# EAGLE design rxfirst (EAGLE 9.5.1)
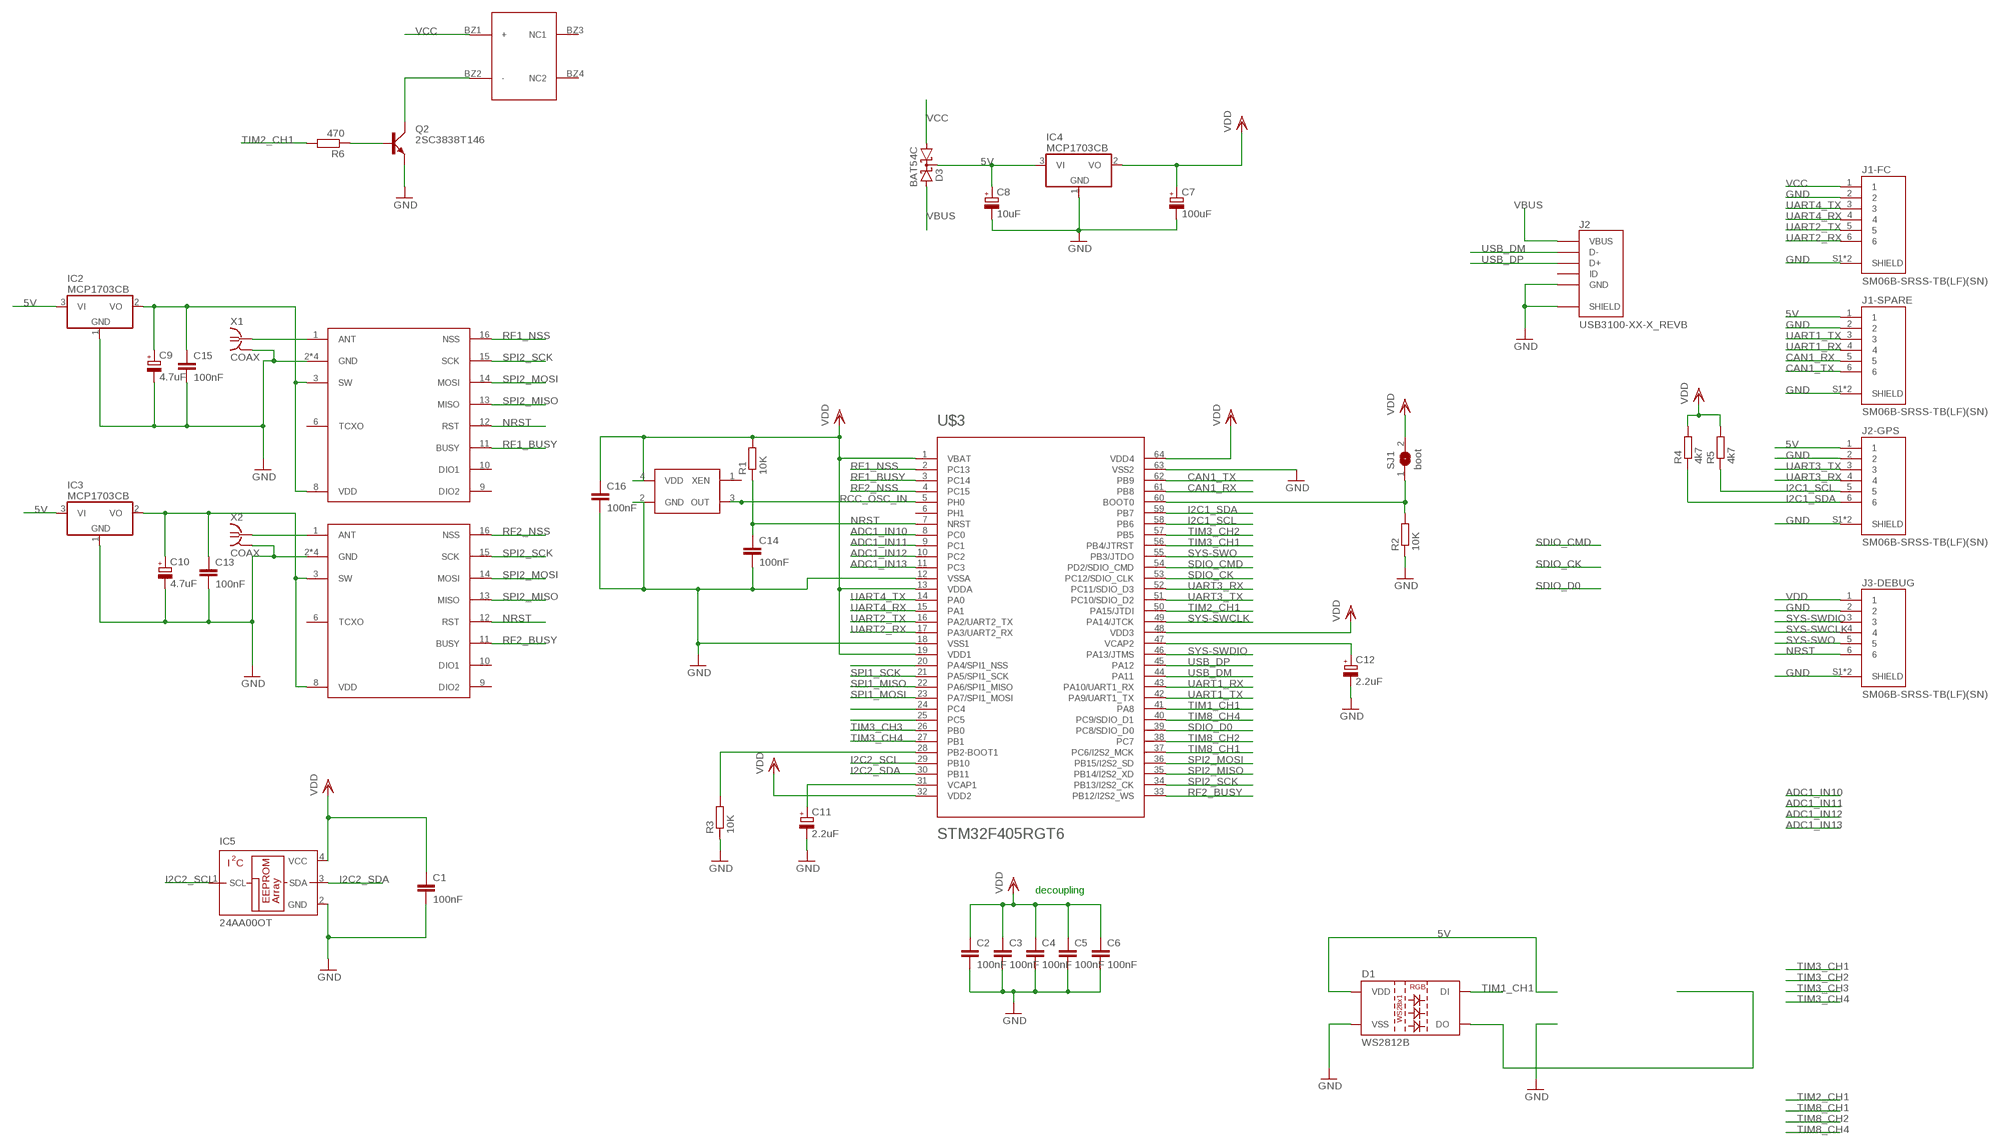
[diagram p0: schematic, sheet 1]

## Parts
C1  100nF  C-EUC0603  [C0603]
C2  100nF  C-EUC0603  [C0603]
C3  100nF  C-EUC0603  [C0603]
C4  100nF  C-EUC0603  [C0603]
C5  100nF  C-EUC0603  [C0603]
C6  100nF  C-EUC0603  [C0603]
C7  100uF  CPOL-EUSMCA  [SMC_A]
C8  10uF  CPOL-EUSMCA  [SMC_A]
C9  4.7uF  CPOL-EUSMCA  [SMC_A]
C10  4.7uF  CPOL-EUSMCA  [SMC_A]
C11  2.2uF  CPOL-EUSMCA  [SMC_A]
C12  2.2uF  CPOL-EUSMCA  [SMC_A]
C13  100nF  C-EUC0603  [C0603]
C14  100nF  C-EUC0603  [C0603]
C15  100nF  C-EUC0603  [C0603]
C16  100nF  C-EUC0603  [C0603]
D1  WS2812B  [WS2812B]
D3  BAT54C  [SOT23]
IC2  MCP1703CB  [SOT23]
IC3  MCP1703CB  [SOT23]
IC4  MCP1703CB  [SOT23]
IC5  24AA00OT  [SOT23-5L]
J1-FC  SM06B-SRSS-TB(LF)(SN)  [JST_SM06B-SRSS-TB(LF)(SN)]
J1-SPARE  SM06B-SRSS-TB(LF)(SN)  [JST_SM06B-SRSS-TB(LF)(SN)]
J2  USB3100-XX-X_REVB  [GCT_USB3100-XX-X_REVB]
J2-GPS  SM06B-SRSS-TB(LF)(SN)  [JST_SM06B-SRSS-TB(LF)(SN)]
J3-DEBUG  SM06B-SRSS-TB(LF)(SN)  [JST_SM06B-SRSS-TB(LF)(SN)]
Q2  2SC3838T146  [SC59]
R1  10K  R-EU_R0603  [R0603]
R2  10K  R-EU_R0603  [R0603]
R3  10K  R-EU_R0603  [R0603]
R4  4k7  R-EU_R0603  [R0603]
R5  4k7  R-EU_R0603  [R0603]
R6  470  R-EU_R0603  [R0603]
RF1  DRF1262T  [SMD]
RF2  DRF1262T  [SMD]
SJ1  boot  SJ  [SJ]
U$1  BZ  [SND]
U$3  STM32F405RGT6  STM32F405RG  [TQFP64]
U$4  XO  [SMD]
X1  COAX  [MMCX-J-P-X-ST-EM1-MKT]
X2  COAX  [MMCX-J-P-X-ST-EM1-MKT]

## Nets
5V: C8.+ D1.1(VDD) D3.3(CC) IC2.3(VI) IC3.3(VI) IC4.3(VI) J1-SPARE.1 J2-GPS.1
ADC1_IN10: U$3.8(PC0)
ADC1_IN11: U$3.9(PC1)
ADC1_IN12: U$3.10(PC2)
ADC1_IN13: U$3.11(PC3)
CAN1_RX: J1-SPARE.5 U$3.61(PB8)
CAN1_TX: J1-SPARE.6 U$3.62(PB9)
GND: C1.2 C2.2 C3.2 C4.2 C5.2 C6.2 C7.- C8.- C9.- C10.- C11.- C12.- C13.2 C14.2 C15.2 C16.2 D1.3(VSS) IC2.1(GND) IC3.1(GND) IC4.1(GND) IC5.2(GND) J1-FC.2 J1-FC.S1(SHIELD) J1-FC.S2(SHIELD) J1-SPARE.2 J1-SPARE.S1(SHIELD) J1-SPARE.S2(SHIELD) J2-GPS.2 J2-GPS.S1(SHIELD) J2-GPS.S2(SHIELD) J2.5(GND) J2.6(SHIELD) J2.7(SHIELD) J2.8(SHIELD) J2.9(SHIELD) J3-DEBUG.2 J3-DEBUG.S1(SHIELD) J3-DEBUG.S2(SHIELD) Q2.E R2.1 R3.1 RF1.2(GND) RF1.4(GND) RF1.5(GND) RF1.7(GND) RF2.2(GND) RF2.4(GND) RF2.5(GND) RF2.7(GND) U$3.12(VSSA) U$3.18(VSS1) U$3.63(VSS2) U$4.2(GND) X1.2@1(GND) X2.2@1(GND)
I2C1_SCL: J2-GPS.5 R5.1 U$3.58(PB6)
I2C1_SDA: J2-GPS.6 R4.1 U$3.59(PB7)
I2C2_SCL: IC5.1(SCL) U$3.29(PB10)
I2C2_SDA: IC5.3(SDA) U$3.30(PB11)
N$1: RF1.1(ANT) X1.1
N$2: R3.2 U$3.28(PB2-BOOT1)
N$3: RF2.1(ANT) X2.1
N$4: C12.+ U$3.47(VCAP2)
N$5: D1.2(DO)
N$6: C9.+ C15.1 IC2.2(VO) RF1.3(SW) RF1.8(VDD)
N$7: C10.+ C13.1 IC3.2(VO) RF2.3(SW) RF2.8(VDD)
N$8: Q2.B R6.1
N$9: Q2.C U$1.BZ2(-)
N$34: U$3.20(PA4/SPI1_NSS)
N$38: U$3.24(PC4)
N$39: U$3.25(PC5)
N$45: C11.+ U$3.31(VCAP1)
N$54: R2.2 SJ1.1 U$3.60(BOOT0)
NRST: C14.1 J3-DEBUG.6 R1.1 RF1.12(RST) RF2.12(RST) U$3.7(NRST)
RCC_OSC_IN: U$3.5(PH0) U$4.3(OUT)
RF1_BUSY: RF1.11(BUSY) U$3.3(PC14)
RF1_NSS: RF1.16(NSS) U$3.2(PC13)
RF2_BUSY: RF2.11(BUSY) U$3.33(PB12/I2S2_WS)
RF2_NSS: RF2.16(NSS) U$3.4(PC15)
SDIO_CK: U$3.53(PC12/SDIO_CLK)
SDIO_CMD: U$3.54(PD2/SDIO_CMD)
SDIO_D0: U$3.39(PC8/SDIO_D0)
SPI1_MISO: U$3.22(PA6/SPI1_MISO)
SPI1_MOSI: U$3.23(PA7/SPI1_MOSI)
SPI1_SCK: U$3.21(PA5/SPI1_SCK)
SPI2_MISO: RF1.13(MISO) RF2.13(MISO) U$3.35(PB14/I2S2_XD)
SPI2_MOSI: RF1.14(MOSI) RF2.14(MOSI) U$3.36(PB15/I2S2_SD)
SPI2_SCK: RF1.15(SCK) RF2.15(SCK) U$3.34(PB13/I2S2_CK)
SYS-SWCLK: J3-DEBUG.4 U$3.49(PA14/JTCK)
SYS-SWDIO: J3-DEBUG.3 U$3.46(PA13/JTMS)
SYS-SWO: J3-DEBUG.5 U$3.55(PB3/JTDO)
TIM1_CH1: D1.4(DI) U$3.41(PA8)
TIM2_CH1: R6.2 U$3.50(PA15/JTDI)
TIM3_CH1: U$3.56(PB4/JTRST)
TIM3_CH2: U$3.57(PB5)
TIM3_CH3: U$3.26(PB0)
TIM3_CH4: U$3.27(PB1)
TIM8_CH1: U$3.37(PC6/I2S2_MCK)
TIM8_CH2: U$3.38(PC7)
TIM8_CH4: U$3.40(PC9/SDIO_D1)
UART1_RX: J1-SPARE.4 U$3.43(PA10/UART1_RX)
UART1_TX: J1-SPARE.3 U$3.42(PA9/UART1_TX)
UART2_RX: J1-FC.6 U$3.17(PA3/UART2_RX)
UART2_TX: J1-FC.5 U$3.16(PA2/UART2_TX)
UART3_RX: J2-GPS.4 U$3.52(PC11/SDIO_D3)
UART3_TX: J2-GPS.3 U$3.51(PC10/SDIO_D2)
UART4_RX: J1-FC.4 U$3.15(PA1)
UART4_TX: J1-FC.3 U$3.14(PA0)
USB_DM: J2.2(D-) U$3.44(PA11)
USB_DP: J2.3(D+) U$3.45(PA12)
VBUS: D3.2(A2) J2.1(VBUS)
VCC: D3.1(A1) J1-FC.1 U$1.BZ1(+)
VDD: C1.1 C2.1 C3.1 C4.1 C5.1 C6.1 C7.+ C16.1 IC4.2(VO) IC5.4(VCC) J3-DEBUG.1 R1.2 R4.2 R5.2 SJ1.2 U$3.1(VBAT) U$3.13(VDDA) U$3.19(VDD1) U$3.32(VDD2) U$3.48(VDD3) U$3.64(VDD4) U$4.4(VDD)
Unconnected: J2.4(ID) RF1.6(TCXO) RF1.9(DIO2) RF1.10(DIO1) RF2.6(TCXO) RF2.9(DIO2) RF2.10(DIO1) U$1.BZ3(NC1) U$1.BZ4(NC2) U$3.6(PH1) U$4.1(XEN)

## Notes on the sheet
- decoupling

## Power pins joined to a net without a drawn wire
GND: X1.2@2(GND) X1.2@3(GND) X1.2@4(GND) X2.2@2(GND) X2.2@3(GND) X2.2@4(GND)

## Library data of the parts
C1-C6 C13-C16 = rcl:C-EU: CAPACITOR, European symbol; SPICEPREFIX: C
C7-C12 = rcl:CPOL-EU: POLARIZED CAPACITOR, European symbol; SPICEPREFIX: C
D1 = SparkFun-LED:WS2812B: WS2812B SMD addressable RGB LED 5x5mm SMD LED with built-in controller IC. Color: Red/Green/Blue mC Rating: RGB: 390, 660, 180 mcd Forward Voltage: RGB: 2.0, 3.0, 3.0 V Packages:WS2812B SparkFun Products: Blynk Board - ESP8266 <https://www.sparkfun.com/products/13794>; PROD_ID: DIO-12503
D3 = diode:BAT54C: Schottky Diodes Source: Fairchild .. BAT54.pdf
IC2-IC4 = linear:MCP1703: 250 mA, 16V, Low Quiescent Current LDO Regulator Source: http://ww1.microchip.com/downloads/en/DeviceDoc/22049b.pdf
IC5 = microchip:24*00: Serial EEPROM 128 bit, I2C (AA = 1.8 V/LC = 2.5 V/C = 5.0 V); MF: MICROCHIP; MPN: 24AA00T-I/OTG; OC_FARNELL: 1331264; OC_NEWARK: 89H3038
J1-FC J1-SPARE J2-GPS J3-DEBUG = SM06B-SRSS-TB_LF__SN_:SM06B-SRSS-TB(LF)(SN): SH Series 6 Position 1 mm Surface Mount Right Angle Side Entry Shrouded Header; AVAILABILITY: Unavailable; DESCRIPTION: SH Series 6 Position 1 mm Surface Mount Right Angle Side Entry Shrouded Header; MF: JST Sales; MP: SM06B-SRSS-TB_LF__SN_; PACKAGE: None; PRICE: None
J2 = USB3100-XX-X_REVB:USB3100-XX-X_REVB: Micro USB Receptacle, Type B, Surface Mount, Horizontal, Top (Reverse) Mount, without Peg; AVAILABILITY: Unavailable; DESCRIPTION: USB3100 Series 5 Pin SMT Right Angle Top Mount Micro USB Receptacle; MF: Global Connector Technology; MP: USB3100-30-A; PACKAGE: None; PRICE: None
Q2 = transistor-small-signal:2SC3838: High-Frequency Amplifier Transistor 11V, 50mA, 3.2GHz (Rohm)
R1-R6 = rcl:R-EU_: RESISTOR, European symbol; SPICEPREFIX: R
RF1 RF2 = Dorji:DRF1262T
SJ1 = jumper:SJ: SMD solder JUMPER
U$1 = buzzer:BZ
U$3 = SparkFun-IC-Microcontroller:STM32F405RG: STM32F405RGT6 ARM DSP Chip used on the WAV Trigger board. IC MCU 32BIT 1MB FLASH 64LQFP Datasheet <https://cdn.sparkfun.com/datasheets/Widgets/STM32F405RGT6.pdf> SparkFun Products WAV Trigger <https://www.sparkfun.com/products/13660> (WIG-13660); PROD_ID: IC-11709
U$4 = xo:XO
X1 X2 = con-samtec:COAX: MMCX STRAIGHT, EDGE MOUNT JACK- 50 OHM Source: http://www.samtec.com/ftppub/cpdf/MMCX-J-P-X-ST-EM1-MKT.pdf; MF: Samtec Inc.; MPN: MMCX-J-P-X-ST-EM1-MKT; OC_FARNELL: unknown; OC_NEWARK: unknown

## Board
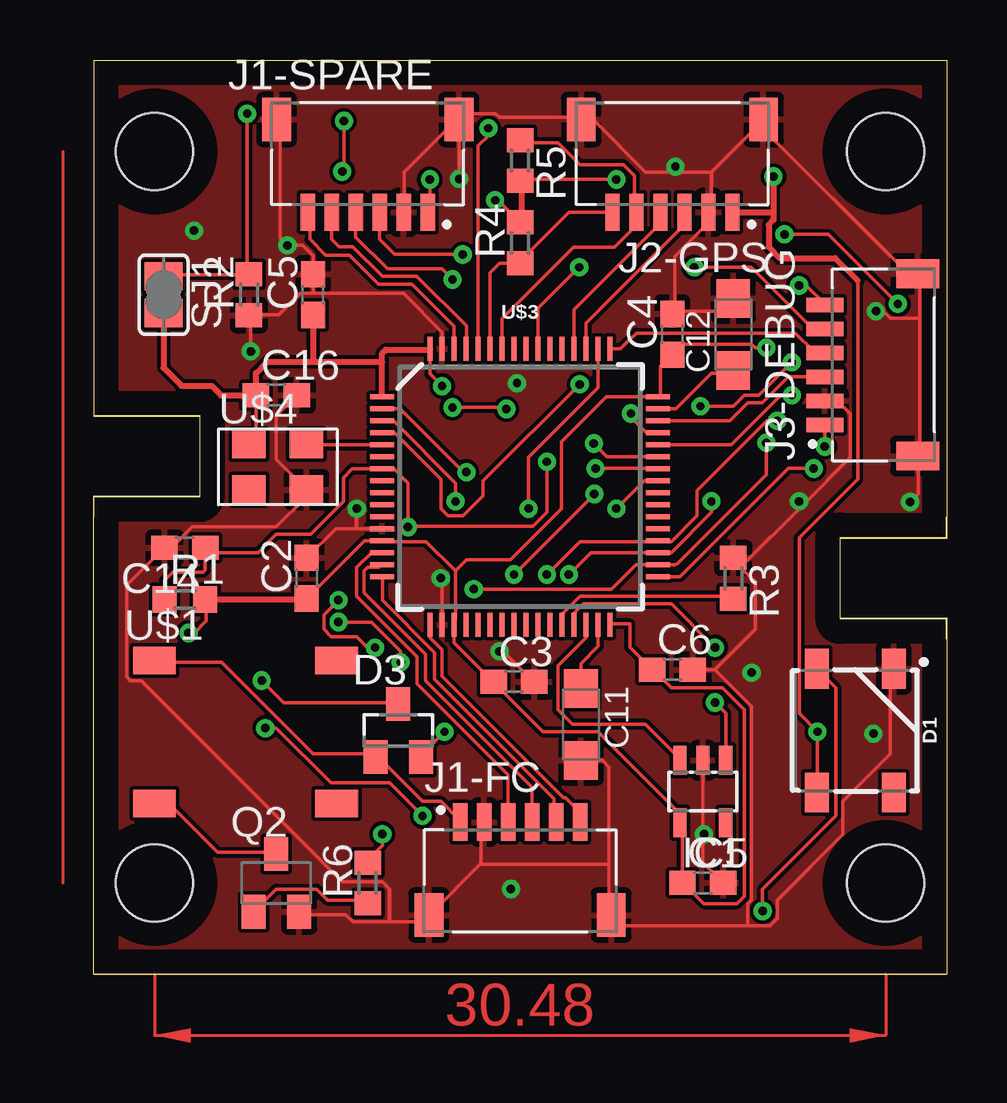
[diagram p1: board, top side]
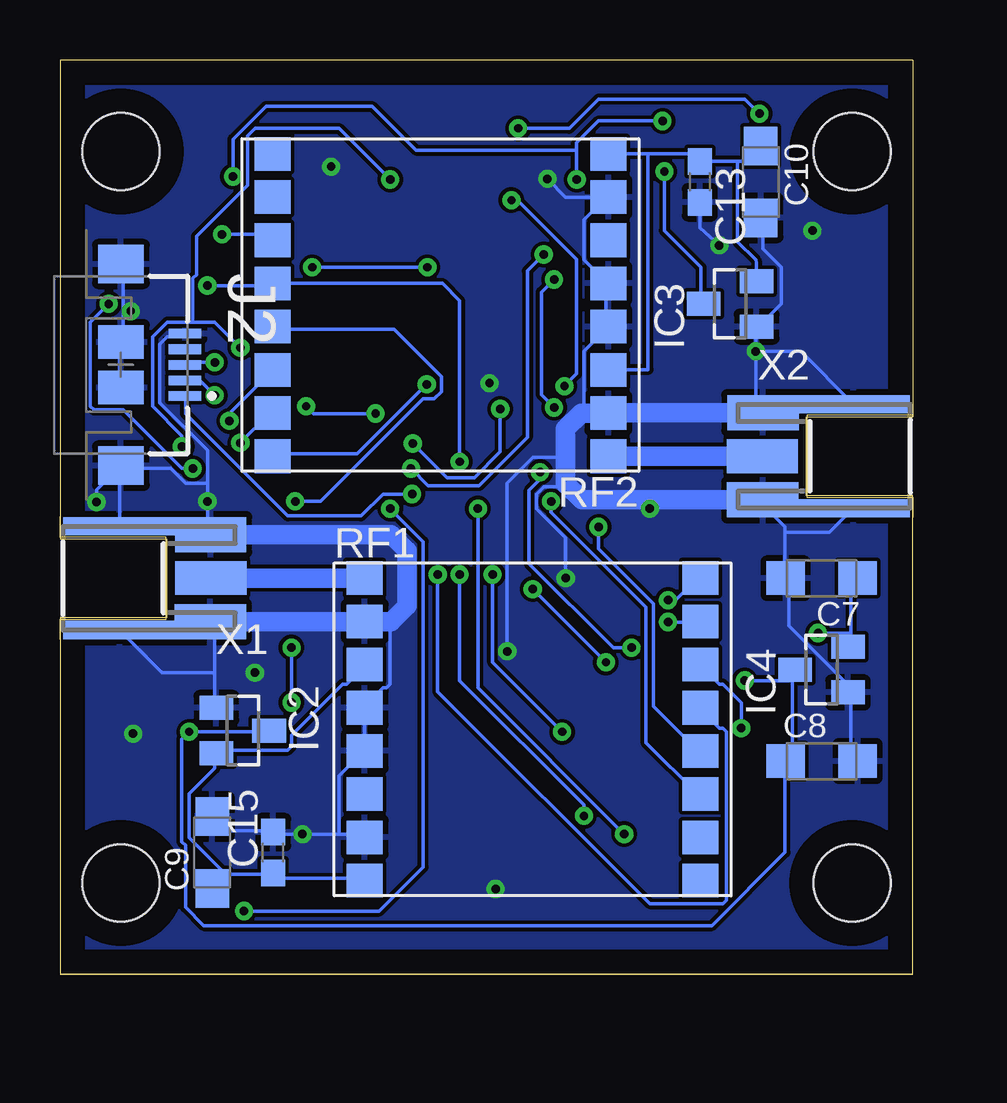
[diagram p2: board, bottom side, seen from below]

Size 35.56 x 38.1 mm. Coordinates in mm from the lower left corner, seen from the top.
Outline: 0,0 35.54,0
Outline: 0,0 35.56,0 35.56,14.86 31.11,14.86 31.11,18.16 35.56,18.16 35.56,38.1 0,38.1 0,23.24 4.45,23.24 4.45,19.94 0,19.94 0,0
Copper layers (1*16): Top 0.035mm / dielectric 1.5mm / Bottom 0.035mm
Design rules "default": minimum track width 6mil, minimum drill 0.35mm, track to track 6mil, track to pad 6mil, pad to pad 6mil, via to via 6mil, smd to smd 6mil, copper to edge 40mil, drill to drill 6mil, minimum pad ring 10mil, minimum via ring 8mil, stop-mask expansion 4mil, vias tented up to drill 0mil, thermal gap 10mil
Holes 3.2 mm at 2.54,3.81 2.54,34.29 33.02,3.81 33.02,34.29

### Footprints (pad centres in the part's own frame; a part is rotated, then mirrored left to right if it is on the bottom)
C0603 = smd 1.1 x 1: 1 -0.85,0; 2 0.85,0
SMC_A = smd 1.6 x 1.4: + -1.5,0; - 1.5,0
WS2812B = smd 1.651 x 1: 1 2.577,-1.6; 2 2.577,1.6; 3 -2.577,1.6; 4 -2.577,-1.6
SOT23 = smd 1 x 1.4: 1 -0.95,-1.1; 2 0.95,-1.1; 3 0,1.1
SOT23-5L = smd 0.55 x 1.2: 1 -0.95,-1.3; 2 0,-1.3; 3 0.95,-1.3; 4 0.95,1.3; 5 -0.95,1.3
JST_SM06B-SRSS-TB(LF)(SN) = smd 0.6 x 1.55: 1 -2.5,0; 2 -1.5,0; 3 -0.5,0; 4 0.5,0; 5 1.5,0; 6 2.5,0 | smd 1.2 x 1.8: S1 -3.8,-3.875; S2 3.8,-3.875
GCT_USB3100-XX-X_REVB = smd 0.4 x 1.35: 1 1.3,2.675; 2 0.65,2.675; 3 0,2.675; 4 -0.65,2.675; 5 -1.3,2.675 | smd 1.4 x 1.9: 6 -0.95,0; 7 0.95,0 | smd 1.6 x 1.9: 8 -4.2,0; 9 4.2,0
SC59 = smd 1 x 1.4: B -0.95,-1.2; C 0,1.2; E 0.95,-1.2
R0603 = smd 1 x 1.1: 1 -0.85,0; 2 0.85,0
SMD = smd 1.5 x 1.4: 1 -7.62,6.35; 2 -7.62,4.55; 3 -7.62,2.75; 4 -7.62,0.95; 5 -7.62,-0.85; 6 -7.62,-2.65; 7 -7.62,-4.45; 8 -7.62,-6.25; 9 6.38,-6.25; 10 6.38,-4.45; 11 6.38,-2.65; 12 6.38,-0.85; 13 6.38,0.95; 14 6.38,2.75; 15 6.38,4.55; 16 6.38,6.35
SJ = smd 1.168 x 1.6: 1 -0.762,0; 2 0.762,0
SND = smd 1.78 x 1.15: BZ1 -3.81,2.54; BZ2 -3.81,-3.42; BZ3 3.78,-3.42; BZ4 3.78,2.54
TQFP64 = smd 0.22 x 1: 1 -3.75,-5.75; 2 -3.25,-5.75; 3 -2.75,-5.75; 4 -2.25,-5.75; 5 -1.75,-5.75; 6 -1.25,-5.75; 7 -0.75,-5.75; 8 -0.25,-5.75; 9 0.25,-5.75; 10 0.75,-5.75; 11 1.25,-5.75; 12 1.75,-5.75; 13 2.25,-5.75; 14 2.75,-5.75; 15 3.25,-5.75; 16 3.75,-5.75; 33 3.75,5.75; 34 3.25,5.75; 35 2.75,5.75; 36 2.25,5.75; 37 1.75,5.75; 38 1.25,5.75; 39 0.75,5.75; 40 0.25,5.75; 41 -0.25,5.75; 42 -0.75,5.75; 43 -1.25,5.75; 44 -1.75,5.75; 45 -2.25,5.75; 46 -2.75,5.75; 47 -3.25,5.75; 48 -3.75,5.75 | smd 1 x 0.22: 17 5.75,-3.75; 18 5.75,-3.25; 19 5.75,-2.75; 20 5.75,-2.25; 21 5.75,-1.75; 22 5.75,-1.25; 23 5.75,-0.75; 24 5.75,-0.25; 25 5.75,0.25; 26 5.75,0.75; 27 5.75,1.25; 28 5.75,1.75; 29 5.75,2.25; 30 5.75,2.75; 31 5.75,3.25; 32 5.75,3.75; 49 -5.75,3.75; 50 -5.75,3.25; 51 -5.75,2.75; 52 -5.75,2.25; 53 -5.75,1.75; 54 -5.75,1.25; 55 -5.75,0.75; 56 -5.75,0.25; 57 -5.75,-0.25; 58 -5.75,-0.75; 59 -5.75,-1.25; 60 -5.75,-1.75; 61 -5.75,-2.25; 62 -5.75,-2.75; 63 -5.75,-3.25; 64 -5.75,-3.75
SMD' = smd 1.4 x 1.2: 1 -1.27,-0.63; 2 1.13,-0.63; 3 1.13,1.27; 4 -1.27,1.27
MMCX-J-P-X-ST-EM1-MKT = smd 1.4 x 2.975: 1 0,-6.15 | smd 1.46 x 2.975: 2@1 -1.812,-6.125; 2@2 1.812,-6.138 | smd 0.76 x 4.7: 2@3 -2.163,-2.35; 2@4 2.163,-2.35

### Placement (x,y rotation side)
C1  25.4,3.81 0 top
C2  8.89,16.51 90 top
C3  17.53,12.19 0 top
C4  24.13,26.67 90 top
C5  9.14,28.32 90 top
C6  24.13,12.7 0 top
C7  3.81,16.51 180 bottom
C8  3.81,8.89 0 bottom
C9  29.21,5.08 90 bottom
C10  6.35,33.02 270 bottom
C11  20.32,10.41 270 top
C12  26.67,26.67 90 top
C13  8.89,33.02 270 bottom
C14  3.81,17.78 180 top
C15  26.67,5.08 90 bottom
C16  7.62,24.13 0 top
D1  31.75,10.16 270 top
D3  12.7,10.16 0 top
IC2  27.94,10.16 270 bottom
IC3  7.62,27.94 90 bottom
IC4  3.81,12.7 90 bottom
IC5  25.4,7.62 180 top
J1-FC  17.78,6.35 0 top
J1-SPARE  11.43,31.75 180 top
J2  33.02,25.4 270 bottom
J2-GPS  24.13,31.75 180 top
J3-DEBUG  30.48,25.4 90 top
Q2  7.62,3.81 0 top
R1  3.81,15.62 0 top
R2  6.48,28.32 90 top
R3  26.67,16.51 270 top
R4  17.78,30.48 90 top
R5  17.78,33.91 270 top
R6  11.43,3.81 90 top
RF1  15.24,10.16 0 bottom
RF2  20.32,27.94 180 bottom
SJ1  2.92,28.32 270 top
U$1  6.35,10.54 0 top
U$3  17.78,20.32 270 top
U$4  [SMD']  7.75,20.83 0 top
X1  35.42,16.51 90 bottom
X2  0.13,21.59 270 bottom

### Tracks (layer width: path | path; a pad name or v marks a point on that pad's centre or on a via)
5V  (via drill 0.35)
  Top 0.152: v10.44,35.56 10.44,33.53 v10.36,33.45 | v14.02,33.12 14.02,31.75 J1-SPARE.1 | v7.01,12.24 7.92,11.33 12.65,11.33 D3.3 | D1.1 30.18,7.67 v30.18,10.11 29.41,10.87 29.41,18.19 31.85,20.62 31.85,28.91
  Top 0.254: 31.85,28.91 30.91,29.84 28.61,29.84 28.15,30.31 28.15,31.23 28.35,31.43 28.35,31.75 | J2-GPS.1 28.35,31.75 | v28.35,33.25 28.35,31.75
  Bottom 0.152: v10.36,33.45 10.36,30.99 8.84,29.46 8.84,27.94 IC3.3 | v10.44,35.56 13.11,35.56 14.02,34.65 14.02,34.34 | v14.02,33.12 14.02,34.34 | 5.03,12.24 5.03,9.04 5.18,8.89 C8.+ 5.33,8.89 5.33,5.08 8.38,2.03 29.57,2.03 30.33,2.79 30.33,5.38 30.48,5.54 30.48,9.8 v30.18,10.11 26.98,10.11 IC2.3 | 5.03,12.24 5.03,12.7 IC4.3 5.03,12.24 | 5.03,12.24 v7.01,12.24 | 14.02,34.34 20.73,34.34 22.55,36.17 26.98,36.17 28.35,34.8 v28.35,33.25
CAN1_RX
  Top 0.152: U$3.61 15.54,26.11 15.54,27.03 13.47,29.1 13.46,29.08 12.04,29.08 10.79,30.33 10.24,30.33 9.93,30.63 J1-SPARE.5
CAN1_TX
  Top 0.152: J1-SPARE.6 9.02,31.66 9.02,30.63 9.68,29.97 10.67,29.97 11.87,28.77 13.27,28.77 15.03,27.01 U$3.62
GND  (via drill 0.35)
  Top 0.152: C16.2 7.62,23.28 7.62,21.45 U$4.2 8.84,20.17 8.84,19.86 7.62,18.64 4.12,18.64 3.35,17.88 3.05,17.88 C14.2 2.9,17.73 1.37,16.21 1.37,12.39 1.52,12.24 1.98,12.24 10.36,3.86 12.04,3.86 12.34,3.56 12.34,2.18 | IC5.2 25.4,5.84 | 25.4,5.84 25.4,4.66 C1.2 | C2.2 10.1,18.57 10.97,18.57 | 10.97,18.57 U$3.12 | v25.45,5.84 25.4,5.84 | 25.91,12.7 C6.2 | 25.91,12.7 27.58,14.38 27.58,16.36 26.98,16.97 | 26.98,16.97 26.67,17.27 R3.1 26.98,16.97 | 26.98,16.97 29.57,19.56 | 29.57,19.56 31.55,21.54 31.55,23.37 31.09,23.82 30.48,23.82 J3-DEBUG.2 | 12.34,2.18 13.72,2.18 13.87,2.34 J1-FC.S1 14.02,2.49 16.15,4.62 | 12.34,2.18 10.82,2.18 10.52,2.49 8.69,2.49 Q2.E | 16.15,4.62 16.15,4.6 21.49,4.6 | 16.15,4.62 16.15,6.3 J1-FC.2 | C11.- 21.21,8.91 21.49,8.64 21.49,4.6 | 21.49,4.6 21.49,2.49 J1-FC.S2 21.64,2.34 21.95,2.03 27.28,2.03 | 27.28,2.03 28.19,2.03 28.5,2.34 28.5,3.1 31.24,5.84 31.24,7.21 33.22,9.2 33.22,12.7 D1.3 | 25.91,12.7 27.43,11.18 27.43,3.1 27.28,2.95 27.28,2.03 | 29.57,19.56 v29.41,19.71 | J1-SPARE.S1 15.09,35.56 12.95,33.43 12.95,31.75 J1-SPARE.2 | J1-SPARE.S1 15.24,35.71 15.39,35.87 16.76,35.87 16.92,35.71 20.27,35.71 J2-GPS.S2 20.42,35.56 20.88,35.56 23.01,33.43 25.76,33.43 | 34.44,27.33 34.44,29.16 J3-DEBUG.S2 34.29,29.31 33.83,29.31 27.74,35.41 | 34.44,27.33 34.44,21.69 34.38,21.63 | 34.38,21.63 J3-DEBUG.S1 | v32.61,27.63 32.92,27.63 33.22,27.33 34.44,27.33 | 24.23,27.63 26.21,27.63 26.67,28.09 C12.- | 25.76,33.43 25.76,31.75 J2-GPS.2 25.6,31.75 25.6,31.29 24.23,29.92 24.23,27.63 | 27.74,35.41 27.89,35.56 J2-GPS.S1 27.74,35.41 | 27.74,35.41 25.76,33.43 | 24.23,27.63 C4.2
  Top 0.152: 9.12,28.37 8.61,28.37 7.72,27.48 6.55,27.48 R2.1 6.55,27.33 v6.55,25.96 | 9.12,28.37 12.92,28.37 14.53,26.77 U$3.63 | 9.12,28.37 9.14,28.4 C5.2 9.14,29.95 8.71,30.38 v8.08,30.38 7.77,30.68 7.77,35.56 J1-SPARE.S2 | v14.48,16.51 14.53,16.46 U$3.18 | v16.92,13.46 17.07,13.46 18.29,12.24 C3.2 | v10.97,19.41 10.97,18.57 | v34.04,19.68 34.38,20.03 34.38,21.63 | J1-SPARE.S1 v15.23,33.16 v15.24,33.15
  Bottom 0.152: C9.- 29.11,6.45 28.65,5.99 26.67,5.99 C15.2 26.67,5.84 v25.45,5.84 23.93,5.84 | 23.93,5.84 22.86,5.84 RF1.7 | 22.86,9.35 RF1.4 22.86,11.18 22.1,11.94 21.95,11.94 21.79,12.09 21.79,14.7 | 29.41,20.47 v29.41,19.71 29.41,18.64 X1.2@2 | 29.41,20.47 29.41,21.84 31.39,23.82 31.39,26.26 31.09,26.57 30.48,26.57 J2.5 | 29.11,12.57 29.11,14.38 X1.2@1 | 29.11,12.57 29.11,11.18 IC2.1 | 29.41,20.47 30.33,20.47 30.94,21.08 32.92,21.08 J2.9 | 23.93,5.84 23.93,8.28 22.86,9.35 | 22.86,9.35 RF1.5 | J2.7 33.07,24.59 33.07,26.26 J2.6 32.92,26.42 32.92,27.63 | 32.92,27.63 32.92,29.46 J2.8 | v32.61,27.63 32.92,27.63 | v8.08,30.38 8.89,31.12 C13.2 | C8.- 2.44,8.89 2.59,9.04 2.59,11.63 IC4.1 2.74,11.79 2.74,12.09 5.18,14.53 5.18,16.51 C7.- 5.33,16.51 5.33,18.41 | v14.48,16.51 14.48,18.19 15.7,19.41 15.7,20.02 15.39,20.32 14.78,20.32 14.48,20.45 | v16.92,13.46 16.92,20.47 15.85,21.54 14.48,21.54 | v6.55,25.96 6.55,23.67 X2.2@1 | v6.55,25.96 6.55,26.87 IC3.1 6.4,27.03 5.49,27.94 5.49,29.46 6.25,30.23 6.25,31.45 C10.- | 5.33,18.41 5.33,18.64 6.1,19.41 X2.2@2 | 13.82,23.39 13.72,23.67 13.72,25.96 12.8,26.87 RF2.4 12.8,27.03 12.8,28.7 RF2.5 12.8,28.85 13.72,29.77 13.72,31.45 12.8,32.36 RF2.7 14.48,32.39 v15.24,33.15 | v10.97,19.41 10.97,19.78 | X2.2@4 3.49,18.41 5.33,18.41 | X2.2@3 4.68,25.96 v6.55,25.96 | X1.2@4 33.07,21.15 J2.9 | X1.2@3 31.29,12.57 29.11,12.57 | J2.9 34.04,20.18 v34.04,19.68
  Bottom 0.813: X1.2@1 22.87,14.7 | 22.87,14.7 RF1.2 | X2.2@1 12.69,23.4 RF2.2 13.82,23.39 14.48,22.73 14.48,21.54 14.48,20.45 13.81,19.78 10.97,19.78 X2.2@2 | X1.2@2 21.75,18.32 21.08,17.65 21.08,15.37 21.75,14.7 21.79,14.7 22.87,14.7
  other vias: 17.4,3.56 32.51,10.03 24.26,33.66 4.19,30.99 27.43,12.57 17.65,24.64
  pour Top: 0,37.97 0,0 35.56,0 35.56,38.1 0,38.1
  pour Bottom: 0,38.1 0,0 35.56,0 35.56,38.1
I2C1_SCL
  Top 0.152: 22.55,31.75 22.55,31.14 21.72,30.3 20.02,30.3 17.07,27.36 17.03,27.32 U$3.58 | 22.55,31.75 22.55,33.27 22.1,33.73 20.27,33.73 19.36,34.65 17.83,34.65 R5.1 | 22.55,31.75 J2-GPS.5
I2C1_SDA
  Top 0.152: U$3.59 16.53,27.94 16.53,28.04 16.53,29.23 16.93,29.63 R4.1 17.83,29.77 19.81,31.75 J2-GPS.6
I2C2_SCL  (via drill 0.35)
  Top 0.152: U$3.29 20.03,15.05 20.42,15.44 24.08,15.44 v25.91,13.61 | v25.91,11.33 26.35,10.89 IC5.1
  Bottom 0.152: v25.91,11.33 v25.91,13.61
I2C2_SDA
  Top 0.152: U$3.30 20.53,14.03 19.36,12.85 19.36,11.02 19.96,10.41 23.01,10.41 24.38,9.04 IC5.3
N$1
  Bottom 0.152: 28.7,16.51 X1.1
  Bottom 0.813: RF1.1 28.7,16.51
N$2
  Top 0.152: U$3.28 19.51,14.68 19.51,14.99 20.27,15.75 26.67,15.75 R3.2
N$3
  Bottom 0.813: X2.1 RF2.1
N$4
  Top 0.152: U$3.47 24.28,23.57 25.76,25.04 26.67,25.04 C12.+
N$6
  Bottom 0.152: 28.65,4.17 26.67,4.17 | 28.65,4.17 29.11,3.71 C9.+ 28.65,4.17 | 28.65,4.17 30.18,5.69 30.18,7.52 29.11,8.59 29.11,9.2 IC2.2 28.96,9.35 26.06,9.35 25.91,9.5 25.91,9.96 23.77,12.09 23.62,12.09 22.86,12.85 RF1.3 | 26.67,4.17 26.52,4.01 22.86,4.01 RF1.8 | 26.67,4.17 C15.1
N$7
  Bottom 0.152: 7.32,33.88 7.01,33.88 6.4,34.49 C10.+ | 7.32,33.88 8.84,33.88 C13.1 8.99,33.88 9.3,34.19 11.05,34.19 | 7.32,33.88 7.32,30.53 6.55,29.77 6.52,29.65 IC3.2 | RF2.3 12.65,25.2 11.05,25.2 11.05,34.19 | 11.05,34.19 12.65,34.19 RF2.8
N$8
  Top 0.152: R6.1 11.43,3.1 9.75,3.1 9.3,3.56 7.62,3.56 6.71,2.64 Q2.B
N$9
  Top 0.152: Q2.C 7.62,5.08 5.18,5.08 3.2,7.06 2.59,7.06 U$1.BZ2
N$45
  Top 0.152: U$3.31 21.03,13.66 20.32,12.95 C11.+
N$54  (via drill 0.35)
  Top 0.152: U$3.60 16.03,34.52 16.46,34.95 v16.46,35.26 | v6.4,35.87 6.4,29.31 R2.2 6.4,29.16 3.05,29.16 SJ1.1
  Bottom 0.152: v16.46,35.26 14.33,35.26 13.11,36.47 7.01,36.47 v6.4,35.87
NRST  (via drill 0.35)
  Top 0.152: v29.41,28.7 29.72,28.7 30.48,27.94 J3-DEBUG.6 | 4.72,17.58 4.72,17.73 C14.1 | 13.11,18.67 13.11,20.47 12.5,21.08 12.04,21.08 U$3.7 10.78,21.07 10.41,20.7 10.41,19.7 9.05,18.34 7.62,18.34 6.86,17.58 4.72,17.58 | 4.72,17.58 C14.1 | v18.9,21.36 18.9,19.25 18.31,18.67 13.11,18.67 | 13.11,18.67 v13.11,18.64 | C14.1 4.66,16.85 4.57,16.76 3.3,16.76 2.96,16.42 R1.1
  Bottom 0.152: v29.41,28.7 26.82,28.7 RF2.12 19.62,28.79 18.9,28.07 v18.9,21.36 | v13.11,18.64 13.11,17.73 10.82,15.44 10.82,11.18 8.99,9.35 RF1.12
RCC_OSC_IN
  Top 0.152: U$3.5 8.9,22.07 U$4.3
RF1_BUSY  (via drill 0.35)
  Top 0.152: v15.09,19.71 15.09,20.47 12.5,23.06 U$3.3
  Bottom 0.152: v15.09,19.71 15.09,19.25 11.12,15.29 11.12,9.65 8.99,7.52 RF1.11
RF1_NSS  (via drill 0.35)
  Top 0.152: v15.54,20.93 15.42,20.93 12.78,23.57 U$3.2 | v11.73,13.61 11.43,13.61 10.97,14.07 9.91,14.07 9.6,14.38 9.6,14.99 v10.21,15.6
  Bottom 0.152: v15.54,20.93 15.54,20.62 16,20.17 16,17.12 12.5,13.61 v11.73,13.61 | v10.21,15.6 9.91,15.6 8.99,16.51 RF1.16
RF2_BUSY  (via drill 0.35)
  Top 0.152: v30.02,21.08 28.96,21.08 24.44,16.57 U$3.33 | v33.53,27.94 30.63,30.84 v28.8,30.84
  Bottom 0.152: v30.02,21.08 30.48,21.08 32.92,23.52 34.14,23.52 34.29,23.67 34.29,27.18 v33.53,27.94 | v28.8,30.84 26.98,30.84 26.82,30.68 RF2.11
RF2_NSS  (via drill 0.35)
  Top 0.152: U$3.4 12.04,22.61 12.5,22.61 14.48,20.62 14.48,19.41 14.78,19.1 15.39,19.1 16.24,19.95 16.24,20.56 v20.27,24.59
  Bottom 0.152: v20.27,24.59 23.16,21.69 26.67,21.69 RF2.16
SPI2_MISO  (via drill 0.35)
  Top 0.152: v25.76,19.71 25.76,19.25 24.08,17.58 23.62,17.58 U$3.35 23.47,17.58 20.73,17.58 v19.81,16.66
  Bottom 0.152: v25.76,19.71 24.69,19.71 20.42,23.98 19.96,23.98 19.66,24.28 19.66,24.89 21.64,26.87 26.67,26.87 RF2.13 | v19.81,16.66 19.81,11.79 10.97,2.95 7.92,2.95 7.77,3.1 7.77,10.11 7.92,10.26 8.08,10.26 8.84,11.02 RF1.13
SPI2_MOSI  (via drill 0.35)
  Top 0.152: v28.5,23.06 28.07,23.06 25.15,20.14 25.15,19.1 24.08,18.03 23.62,18.03 U$3.36 23.47,18.03 20.27,18.03 v18.9,16.66 | v7.16,10.26 7.62,10.26 9.91,7.98 12.34,7.98 v13.72,6.6
  Bottom 0.152: v28.5,23.06 28.5,23.37 26.82,25.04 RF2.14 | v7.16,10.26 7.16,11.33 7.92,12.09 8.08,12.09 8.84,12.85 RF1.14 | v13.72,6.6 13.72,7.06 18.9,12.24 v18.9,16.66
SPI2_SCK  (via drill 0.35)
  Top 0.152: v28.04,22.15 28.04,20.83 24.33,17.12 24.24,17.07 U$3.34 22.61,17.07 21.59,16.05 v15.85,16.05 | v10.21,14.68 11.58,14.68 12.8,13.46 v12.8,13
  Bottom 0.152: v28.04,22.15 26.82,23.37 RF2.15 | v10.21,14.68 8.99,14.68 RF1.15 | v15.85,16.05 v12.8,13
SYS-SWCLK
  Top 0.152: U$3.49 21.97,26.07 22.62,26.72 29.26,26.72 30.02,25.96 30.48,25.96 J3-DEBUG.4
SYS-SWDIO
  Top 0.152: U$3.46 23.62,23.06 26.52,23.06 27.28,23.82 27.89,23.82 28.96,24.89 J3-DEBUG.3
SYS-SWO  (via drill 0.35)
  Top 0.152: v20.24,29.46 18.53,27.75 U$3.55 | v25.04,29.46 27.43,29.46 29.87,27.03 30.48,27.03 J3-DEBUG.5
  Bottom 0.152: v25.04,29.46 v20.24,29.46
TIM1_CH1  (via drill 0.35)
  Top 0.152: U$3.41 22.96,20.57 v21.79,19.41 | v27.89,2.64 27.89,3.56 30.94,6.6 30.94,11.94 30.18,12.7 D1.4
  Bottom 0.152: v21.79,19.41 20.42,18.03 20.42,4.47 22.25,2.64 v27.89,2.64
TIM2_CH1  (via drill 0.35)
  Top 0.152: v18.14,19.41 18.14,20.57 18.14,20.62 18.14,21.54 19.2,22.61 21.03,24.43 21.03,25.96 U$3.50 | v12.04,5.84 12.04,5.38 11.43,4.78 R6.2
  Bottom 0.152: v18.14,19.41 18.14,11.94 v12.04,5.84
UART1_RX  (via drill 0.35)
  Top 0.152: v20.85,22.12 21.41,21.57 U$3.43 | J1-SPARE.4 10.93,30.72 12.25,29.4 14.52,29.4 v14.96,28.96 | v14.96,23.62 17.14,23.62 v17.21,23.56
  Bottom 0.152: v14.96,23.62 15.49,24.15 15.49,28.43 v14.96,28.96 | v17.21,23.56 17.21,21.78 18.29,20.7 19.43,20.7 v20.85,22.12
UART1_TX  (via drill 0.35)
  Top 0.152: v20.93,21.08 23.47,21.08 U$3.42 | v15.39,30 12.55,30 11.91,30.63 11.91,31.73 J1-SPARE.3
  Bottom 0.152: v20.93,21.08 20.22,20.37 18.09,20.37 16.08,22.38 16.08,29.31 v15.39,30
UART2_RX
  Top 0.152: U$3.17 14.03,14.04 14.53,13.54 14.53,12.42 19.59,7.35 19.68,7.35 20.28,6.75 J1-FC.6
UART2_TX
  Top 0.152: U$3.16 12.04,16.51 12.04,15.6 14.22,13.41 14.22,12.29 19.2,7.31 19.2,6.45 J1-FC.5
UART3_RX
  Top 0.152: U$3.52 20.03,27.7 23.62,31.29 J2-GPS.4
UART3_TX
  Top 0.152: U$3.51 20.53,27.13 24.54,31.14 24.54,31.75 J2-GPS.3
UART4_RX
  Top 0.152: U$3.15 11.89,16.97 11.43,16.97 11.28,16.82 11.28,15.9 13.84,13.33 13.84,12.24 18.28,7.81 J1-FC.4
UART4_TX
  Top 0.152: U$3.14 11.89,17.58 11.58,17.58 10.97,16.97 10.97,15.75 13.49,13.23 13.49,12.11 17.28,8.32 J1-FC.3
USB_DM  (via drill 0.35)
  Top 0.152: v29.11,24.13 28.65,24.13 26.59,22.07 U$3.44
  Bottom 0.152: v29.11,24.13 29.72,24.74 30.33,24.74 J2.2
USB_DP  (via drill 0.35)
  Top 0.152: v22.4,23.37 22.4,23.22 23.01,22.61 23.47,22.61 U$3.45 | v25.3,23.67 26.67,23.67 27.13,24.13 27.74,24.13 v29.11,25.5
  Bottom 0.152: v22.4,23.37 24.99,23.37 v25.3,23.67 | v29.11,25.5 30.33,25.5 J2.3
VBUS  (via drill 0.35)
  Top 0.152: v17.53,16.66 v20.88,20.02 | v14.63,10.11 13.72,9.2 D3.2
  Bottom 0.152: v20.88,20.02 22.1,20.02 23.01,19.1 26.06,19.1 30.33,23.37 30.33,23.98 J2.1 | v17.53,16.66 17.53,13 v14.63,10.11
VCC
  Top 0.152: J1-FC.1 15.24,6.45 14.48,7.21 13.72,7.21 11.89,9.04 D3.1 11.73,9.2 9.14,9.2 5.33,13 2.59,13 U$1.BZ1
VDD  (via drill 0.35)
  Top 0.152: C16.1 6.77,22.39 U$4.4 | U$3.32 21.57,14.61 22.35,14.61 22.35,13.63 C6.1 23.32,12.7 24.08,11.94 26.21,11.94 27.13,11.02 27.13,3.25 26.82,2.95 25.45,2.95 24.69,3.71 C1.1 24.55,6.22 IC5.4 24.38,6.45 24.38,6.76 21.03,10.11 18.75,10.11 16.76,12.09 C3.1 16.61,12.24 15.03,13.82 U$3.19 15.03,14.7 15.09,14.81 15.09,16.82 | U$3.64 14.03,26.04 14.03,25.36 14.02,25.35 14.02,25.02 v14.53,24.51 | 17.83,31.45 R4.2 16.85,32.26 v16.74,32.26 | 17.83,32.97 R5.2 17.83,33.12 v21.79,33.12 | v30.48,22 J3-DEBUG.1 | v28.04,26.11 27.58,26.11 27.43,26.26 24.54,26.26 24.23,25.96 C4.1 24.08,25.81 23.62,25.35 23.62,24.13 U$3.48 21.38,24.07 19.51,22.2 19.51,19.41 17.37,17.27 15.54,17.27 15.09,16.82 | 15.09,16.82 13.87,18.03 12.04,18.03 U$3.13 11.3,18.07 C2.1 8.84,15.6 8.81,15.62 | v3.96,14.22 4.19,14.22 4.7,14.73 4.7,15.58 R1.2
  Top 0.254: SJ1.2 2.92,25.27 3.67,24.52 4.92,24.52 5.32,24.13 C16.1 6.77,25.06 7.24,25.53 9.14,25.53 | 17.83,32.97 17.83,31.45 | U$3.1 12.03,25.53 | 12.03,25.53 12.03,25.87 12.19,26.04 14.03,26.04 | 9.14,25.53 12.03,25.53 | C5.1 9.14,25.53 | R1.2 8.81,15.62
  Bottom 0.152: v30.48,22 30.48,22.45 31.7,23.67 31.7,26.57 31.09,27.18 30.02,27.18 | 30.02,27.18 29.11,27.18 v28.04,26.11 | v21.79,33.12 23.93,35.26 27.43,35.26 27.74,34.95 27.74,32.89 29.87,30.75 29.87,29.16 30.02,29.01 30.02,27.18 | v14.53,24.51 14.02,25.02 14.02,29.79 16.48,32.26 v16.74,32.26 | 2.59,14.22 2.59,16.36 2.44,16.51 C7.+ | 2.59,14.22 2.59,13.77 IC4.2 | v3.96,14.22 2.59,14.22
(copper drawn outside any net)
  shapes: Top area x2